# EAGLE schematic scd55104_chess_clock (EAGLE 6.5.0)
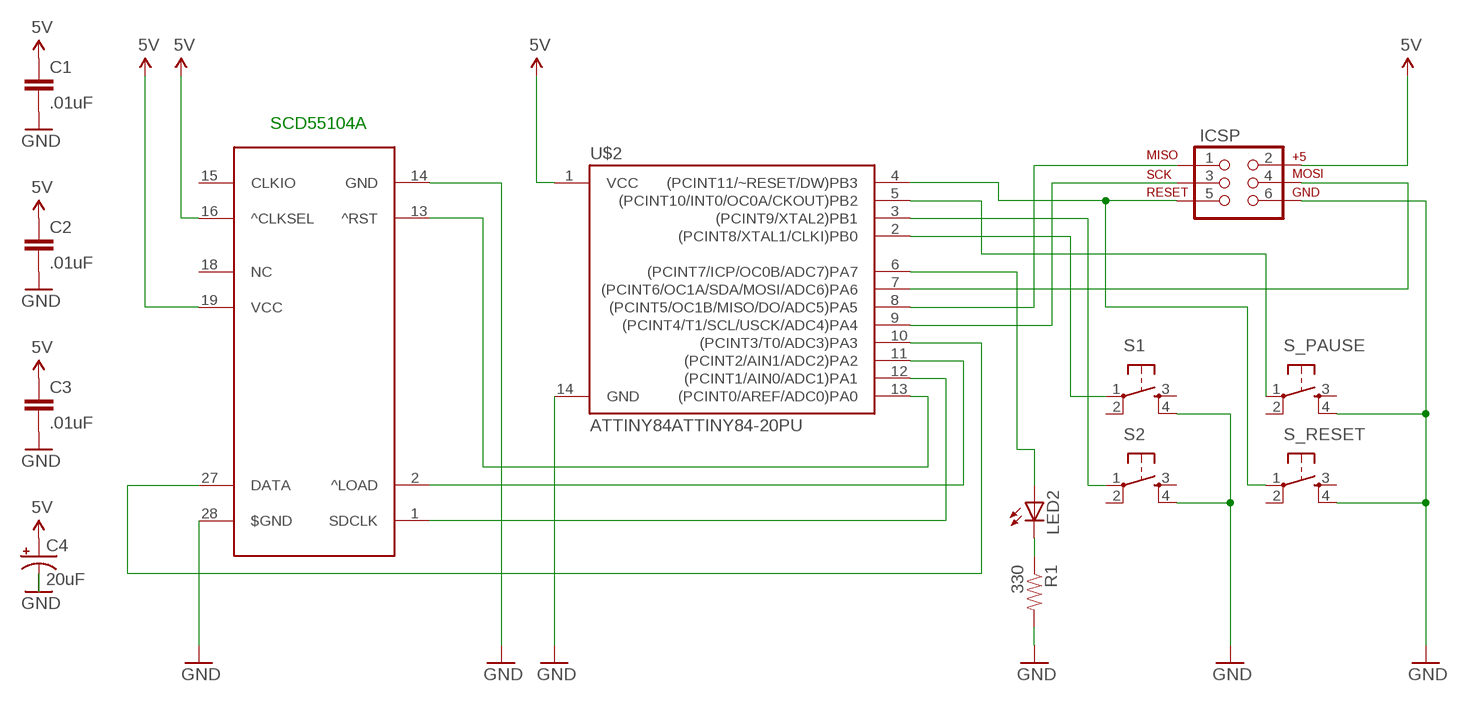
[diagram p0: schematic, sheet 1]

## Parts
C1  .01uF  CAPPTH  [CAP-PTH-SMALL]
C2  .01uF  CAPPTH  [CAP-PTH-SMALL]
C3  .01uF  CAPPTH  [CAP-PTH-SMALL]
C4  20uF  CAP_POLPTH2  [CPOL-RADIAL-10UF-25V]
ICSP  AVR_SPI_PRG_6PTH  [2X3]
LED2  LED3MM  [LED3MM]
R1  330  RESISTORPTH-1/4W  [AXIAL-0.4]
S1  TAC_SWITCHPTH  [TACTILE-PTH]
S2  TAC_SWITCHPTH  [TACTILE-PTH]
S_PAUSE  TAC_SWITCHPTH  [TACTILE-PTH]
S_RESET  TAC_SWITCHPTH  [TACTILE-PTH]
SCD55104A  SCD_55104A  [SCD55104A]
U$2  ATTINY84ATTINY84-20PU  [DIL14]

## Nets
5V: C1.1 C2.1 C3.1 C4.1(+) ICSP.2 SCD55104A.16(^CLKSEL) SCD55104A.19(VCC) U$2.1(VCC)
GND: C1.2 C2.2 C3.2 C4.2(-) ICSP.6 R1.P$2 S1.4 S2.4 S_PAUSE.4 S_RESET.4 SCD55104A.14(GND) SCD55104A.28($GND) U$2.14(GND)
N$2: SCD55104A.13(^RST) U$2.13((PCINT0/AREF/ADC0)PA0)
N$3: ICSP.4 U$2.7((PCINT6/OC1A/SDA/MOSI/ADC6)PA6)
N$4: ICSP.5 S_RESET.1 U$2.4((PCINT11/~RESET/DW)PB3)
N$5: ICSP.1 U$2.8((PCINT5/OC1B/MISO/DO/ADC5)PA5)
N$6: ICSP.3 U$2.9((PCINT4/T1/SCL/USCK/ADC4)PA4)
N$7: SCD55104A.1(SDCLK) U$2.12((PCINT1/AIN0/ADC1)PA1)
N$8: SCD55104A.2(^LOAD) U$2.11((PCINT2/AIN1/ADC2)PA2)
N$9: S1.1 U$2.2((PCINT8/XTAL1/CLKI)PB0)
N$10: S2.1 U$2.3((PCINT9/XTAL2)PB1)
N$11: LED2.K(C) R1.P$1
N$12: S_PAUSE.1 U$2.5((PCINT10/INT0/OC0A/CKOUT)PB2)
N$13: LED2.A U$2.6((PCINT7/ICP/OC0B/ADC7)PA7)
N$14: SCD55104A.27(DATA) U$2.10((PCINT3/T0/ADC3)PA3)
Unconnected: S1.2 S1.3 S2.2 S2.3 S_PAUSE.2 S_PAUSE.3 S_RESET.2 S_RESET.3 SCD55104A.15(CLKIO) SCD55104A.18(NC)

## Notes on the sheet
- SCD55104A

## Library data of the parts
C1-C3 = SparkFun-Passives:CAP: Capacitor Standard 0603 ceramic capacitor, and 0.1" leaded capacitor.
C4 = SparkFun-Passives:CAP_POL: Capacitor Polarized These are standard SMD and PTH capacitors. Normally 10uF, 47uF, and 100uF in electrolytic and tantalum varieties. Always verify the external diameter of the through hole cap, it varies with capacity, voltage, and manufacturer. The EIA devices should be standard.
ICSP = SparkFun-Connectors:AVR_SPI_PRG_6: AVR ISP 6 Pin This is the reduced ISP connector for AVR programming. Common on Arduino. This footprint will take up less PCB space and can be used with a 10-pin to 6-pin adapter such as SKU: BOB-08508
LED2 = adafruit:LED: LED OSRAM: - CHIPLED LG R971, LG N971, LY N971, LG Q971, LY Q971, LO R971, LY R971 LH N974, LH R974 LS Q976, LO Q976, LY Q976 LO Q996 - Hyper CHIPLED LW Q18S LB Q993, LB Q99A, LB R99A - SideLED LS A670, LO A670, LY A670, LG A670, LP A670 LB A673, LV A673, LT A673, LW A673 LH A674 LY A675 LS A676, LA A676, LO A676, LY A676, LW A676 LS A679, LY A679, LG A679 - Hyper Micro SIDELED® LS Y876, LA Y876, LO Y876, LY Y876 LT Y87S - SmartLED LW L88C, LW L88S LB L89C, LB L89S, LG L890 LS L89K, LO L89K, LY L89K LS L896, LA L896, LO L896, LY L896 - TOPLED LS T670, LO T670, LY T670, LG T670, LP T670 LSG T670, LSP T670, LSY T670, LOP T670, LYG T670 LG T671, LOG T671, LSG T671 LB T673, LV T673, LT T673, LW T673 LH T674 LS T676, LA T676, LO T676, LY T676, LB T676, LH T676, LSB T676, LW T676 LB T67C, LV T67C, LT T67C, LS T67K, LO T67K, LY T67K, LW E67C LS E67B, LA E67B, LO E67B, LY E67B, LB E67C, LV E67C, LT E67C LW T67C LS T679, LY T679, LG T679 LS T770, LO T770, LY T770, LG T770, LP T770 LB T773, LV T773, LT T773, LW T773 LH T774 LS E675, LA E675, LY E675, LS T675 LS T776, LA T776, LO T776, LY T776, LB T776 LHGB T686 LT T68C, LB T68C - Hyper Mini TOPLED® LB M676 - Mini TOPLED Santana® LG M470 LS M47K, LO M47K, LY M47K Source: http://www.osram.convergy.de/
R1 = SparkFun-Passives:RESISTOR: Resistor Basic schematic elements and footprints for 0603, 1206, and PTH resistors.
S1 S2 S_PAUSE S_RESET = SparkFun-Electromechanical:TAC_SWITCH: Momentary Switch Button commonly used for reset or general input. Spark Fun Electronics SKU : COM-00097 SMT- SWCH-08247
SCD55104A = DL1416_Library:SCD_55104A
U$2 = SparkFun-DigitalIC:ATTINY84: Atmel 14-pin 2/4/8kB flash uC